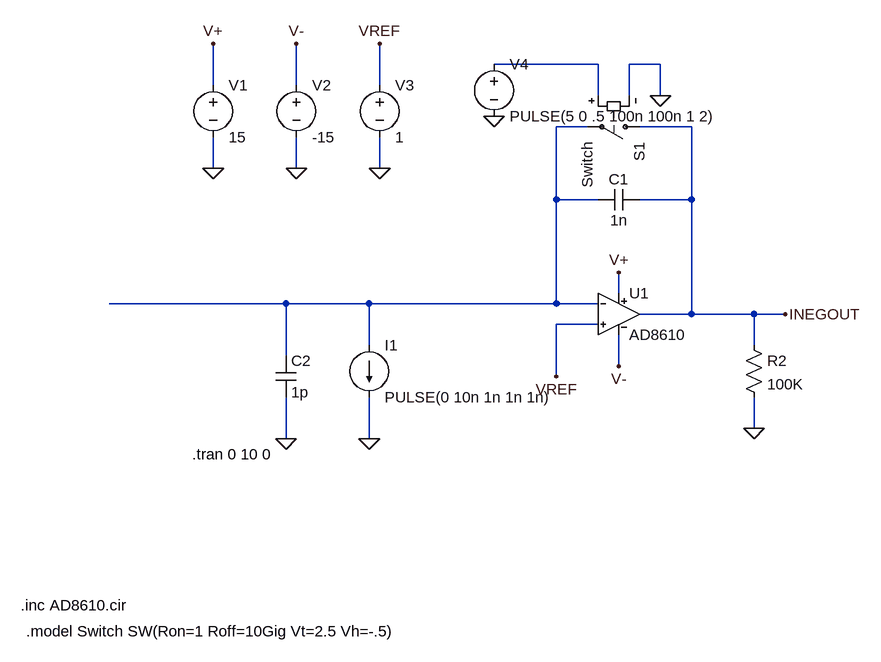
[diagram p0: schematic AD8610Simulation.asc]
AD8610Simulation.asc, the LTspice schematic file:
Version 4
SHEET 1 1120 840
WIRE 288 -48 128 -48
WIRE 384 -48 336 -48
WIRE -304 -16 -304 -80
WIRE -176 -16 -176 -80
WIRE -48 -16 -48 -80
WIRE 288 0 288 -48
WIRE 336 0 336 -48
WIRE 384 0 384 -48
WIRE 272 48 224 48
WIRE 432 48 352 48
WIRE -304 112 -304 64
WIRE -176 112 -176 64
WIRE -48 112 -48 64
WIRE 224 160 224 48
WIRE 288 160 224 160
WIRE 432 160 432 48
WIRE 432 160 352 160
WIRE 320 304 320 272
WIRE -192 320 -464 320
WIRE -64 320 -192 320
WIRE 224 320 224 160
WIRE 224 320 -64 320
WIRE 288 320 224 320
WIRE 432 336 432 160
WIRE 432 336 352 336
WIRE 528 336 432 336
WIRE 576 336 528 336
WIRE 288 352 224 352
WIRE -64 384 -64 320
WIRE 528 384 528 336
WIRE -192 400 -192 320
WIRE 320 416 320 368
WIRE 224 432 224 352
WIRE 528 512 528 464
WIRE -192 528 -192 464
WIRE -64 528 -64 464
FLAG 320 272 V+
FLAG 320 416 V-
FLAG -304 112 0
FLAG -304 -80 V+
FLAG -176 112 0
FLAG -176 -80 V-
FLAG -64 528 0
FLAG -192 528 0
FLAG -48 112 0
FLAG -48 -80 VREF
FLAG 224 432 VREF
FLAG 576 336 INEGOUT
FLAG 528 512 0
FLAG 384 0 0
FLAG 128 32 0
SYMBOL AD8610Wrapper 320 272 R0
SYMATTR InstName U1
SYMBOL cap 352 144 R90
WINDOW 0 0 32 VBottom 2
WINDOW 3 32 32 VTop 2
SYMATTR InstName C1
SYMATTR Value 1n
SYMBOL voltage -304 -32 R0
WINDOW 123 0 0 Left 0
WINDOW 39 0 0 Left 0
SYMATTR InstName V1
SYMATTR Value 15
SYMBOL voltage -176 -32 R0
WINDOW 123 0 0 Left 0
WINDOW 39 0 0 Left 0
SYMATTR InstName V2
SYMATTR Value -15
SYMBOL cap -208 400 R0
SYMATTR InstName C2
SYMATTR Value 1p
SYMBOL current -64 384 R0
WINDOW 123 0 0 Left 0
WINDOW 39 0 0 Left 0
SYMATTR InstName I1
SYMATTR Value PULSE(0 10n 1n 1n 1n)
SYMBOL voltage -48 -32 R0
WINDOW 123 0 0 Left 0
WINDOW 39 0 0 Left 0
SYMATTR InstName V3
SYMATTR Value 1
SYMBOL res 512 368 R0
SYMATTR InstName R2
SYMATTR Value 100K
SYMBOL sw 368 48 R90
SYMATTR InstName S1
SYMATTR Value Switch
SYMBOL voltage 128 -64 R0
WINDOW 123 0 0 Left 0
WINDOW 39 0 0 Left 0
SYMATTR InstName V4
SYMATTR Value PULSE(5 0 .5 100n 100n 1 2)
TEXT -336 552 Left 2 !.tran 0 10 0
TEXT -600 784 Left 2 !.inc AD8610.cir
TEXT -592 824 Left 2 !.model Switch SW(Ron=1 Roff=10Gig Vt=2.5 Vh=-.5)

The netlist it stands for:
* AD8610Simulation.asc
XU1 VREF N002 V+ V- INEGOUT AD8610  ; pins In+ In- V+ V- OUT
C1 INEGOUT N002 1n
V1 V+ 0 15
V2 V- 0 -15
C2 N002 0 1p
I1 N002 0 PULSE(0 10n 1n 1n 1n)
V3 VREF 0 1
R2 INEGOUT 0 100K
S1 INEGOUT N002 N001 0 Switch
V4 N001 0 PULSE(5 0 .5 100n 100n 1 2)
.tran 0 10 0
.inc AD8610.cir
.model Switch SW(Ron=1 Roff=10Gig Vt=2.5 Vh=-.5)
.lib ADI1.lib
.backanno
.end